# Altium schematic sheet BIAS_CIRCUIT_BOARD.SchDoc
size 420 x 297 mm; SheetNumber: 1; SheetTotal: 1; Razrabotal: {Разработал}; Proveril: {Проверил}; Tkontr: {Т.контр}; Nkontr: {Н. контр.}; Utverdil: {Утвердил}; Oboznachenie: {Обозначение}; Naimenovanie: {Наименование}; Naymenuvannya2: {Найменування2}; MisceVudannya: {Місце видання}
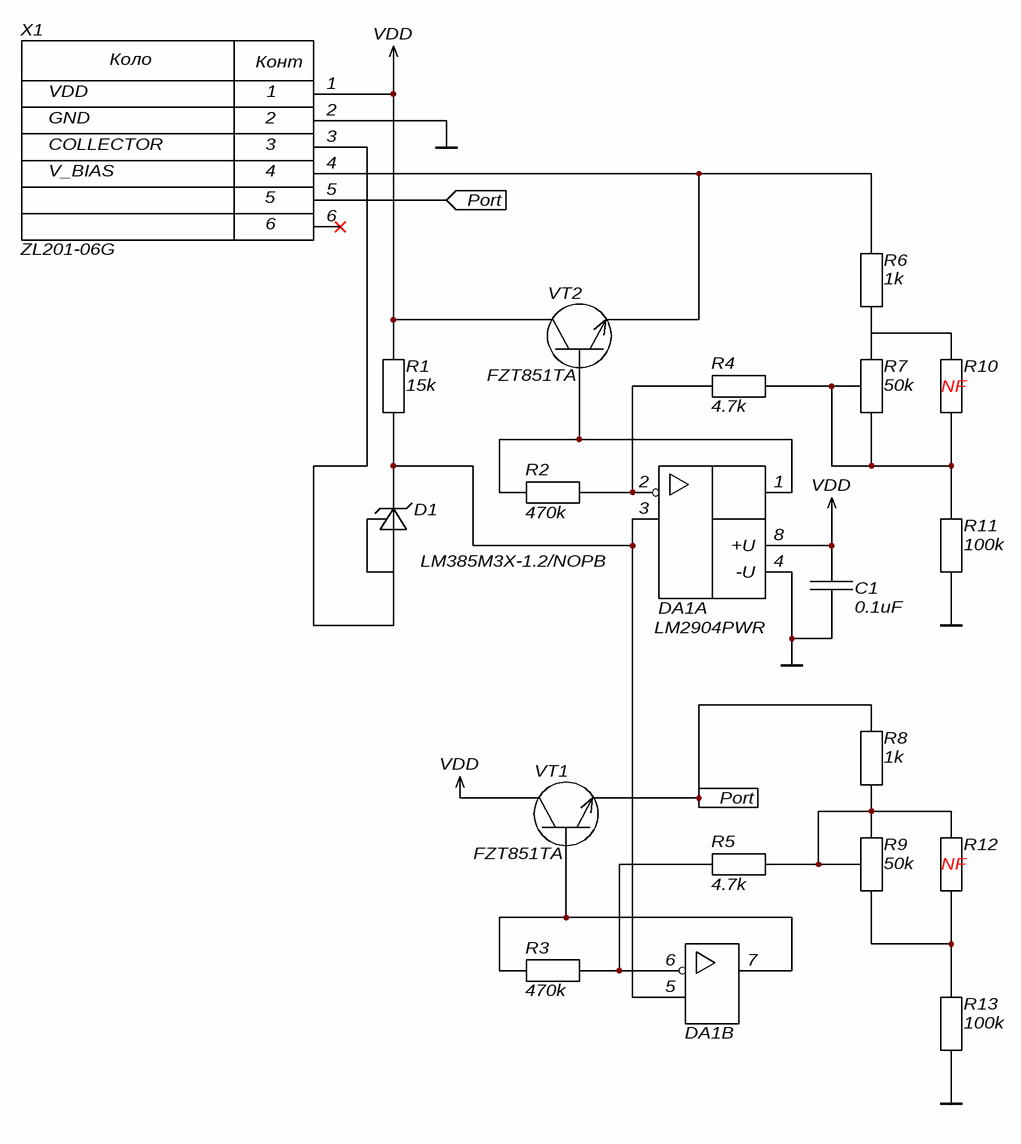
[diagram p0: BIAS_CIRCUIT_BOARD.SchDoc]

## Parts
C1  0.1uF  [CAP_0603]
D1  LM385M3X-1.2/NOPB  [LM385]
DA1  LM2904PWR  [LM2904PWR]  (parts A,B of 2)
R1  15k  [RC0603N_YAG-L]
R2  470k  [RC0603N_YAG-L]
R3  470k  [RC0603N_YAG-L]
R4  4.7k  [RC0603N_YAG-L]
R5  4.7k  [RC0603N_YAG-L]
R6  1k  [RC0603N_YAG-L]
R7  50k  [3214W-1-503E]
R8  1k  [RC0603N_YAG-L]
R9  50k  [3214W-1-503E]
R10  *  [RC0603N_YAG-L]  (value not drawn)
R11  100k  [RC0603N_YAG-L]
R12  *  [RC0603N_YAG-L]  (value not drawn)
R13  100k  [RC0603N_YAG-L]
VT1  FZT851TA  [SOT223_DN_FZT_DIO-L]
VT2  FZT851TA  [SOT223_DN_FZT_DIO-L]
X1  ZL201-06G  [ZL319-6P]

## Ports
Port (in, see BIAS_CIRCUIT_BOARD[3A]), Port (in, see BIAS_CIRCUIT_BOARD[3C])

## Nets
GND: C1.1 DA1.4(-U) R11.1 R13.1 X1.2
VDD: C1.2 DA1.8(+U) R1.2 VT1.2(k) VT2.2(k) X1.1
Port: R8.2 VT1.3(e) X1.5 ; port Port
NetD1_1: D1.1 DA1.3(IN2+) DA1.5(IN2+) R1.1
NetD1_2: D1.2 D1.3 X1.3
NetDA1_1: DA1.1(OUT1) R2.2 VT2.1(b)
NetDA1_2: DA1.2(IN1-) R2.1 R4.2
NetDA1_6: DA1.6(IN1-) R3.1 R5.2
NetDA1_7: DA1.7(OUT1) R3.2 VT1.1(b)
NetR4_1: R4.1 R7.1 R7.3 R10.1 R11.2
NetR5_1: R5.1 R8.1 R9.2 R9.3 R12.2
NetR6_1: R6.1 R7.2 R10.2
NetR6_2: R6.2 VT2.3(e) X1.4
NetR9_1: R9.1 R12.1 R13.2

Not connected (* = marked no-connect by the designer): X1 6(2)*

## Notes on the sheet
- (near R10) NF
- (near R12) NF
- Перв. застосування
- Довідк. №
- Підп. і дата
- Інв. № дубл.
- Зам. інв. №
- Зм.
- Розробив
- Арк.
- № докум.
- Підп.
- Дата
- Літ.
- Маса
- Масштаб
- Перевірив
- Т.контр.
- Схема електрична принципова
- Аркуш
- Аркушів
- Інв. № оріг.
- Н.контр.
- Затв.
- ALTIUM GOSTBOM2.0 KEV
- Файл:
- Копіював
- Формат А3
- (in symbol ZL201-06G_1) Коло; Конт; VDD; GND; COLLECTOR; V_BIAS

## Library data of the parts
C1 = CAPASITOR_0603
D1 = LM385M3X-1.2/NOPB: LM385M3X-1.2/NOPB, SOT-23-3, TI; ComponentLink1Description: Datasheet; ComponentLink1URL: https://www.ti.com/lit/ds/symlink/lm185-1.2-n.pdf?ts=1757397643324
DA1 = LM2904PWR: LM2904PWR, TSSOP, TI; ComponentLink1Description: Datasheet; ComponentLink1URL: https://www.ti.com/lit/ds/symlink/lm2904.pdf?ts=1762592653516&ref_url=https%253A%252F%252Fwww.ti.com%252Fproduct%252FLM2904%253Futm_source%253Dgoogle%2526utm_medium%253Dcpc%2526utm_campaign%253Dasc-amps-null-44700045336317476_prodfolderdynamic-cpc-pf-google-eu_en_int%2526utm_content%253Dprodfolddynamic%2526ds_k%253DDYNAMIC+SEARCH+ADS%2526DCM%253Dyes%2526gclsrc%253Daw.ds%2526gad_source%253D1%2526gad_campaignid%253D8751784064%2526gbraid%253D0AAAAAC068F2Jj8cWNr6MbiQMqKOJ94by2%2526gclid%253DCjwKCAiA8bvIBhBJEiwAu5ayrPYk3AikubklvKvJ7sx7r7PcstoJJPYu8ilBJi-cdwp2x1pJwQd5vhoCyGYQAvD_BwE
R1-R6 R8 R10-R13 = RES_0603: ComponentLink1Description: Datasheet; ComponentLink1URL: https://www.digikey.com/Site/Global/Layouts/DownloadPdf.ashx?pdfUrl=79FA4E6269084805AAD01E8F0265FFC8
R7 R9 = TRIMPOT 50K: 3214W-1-503E, 50k, 1/4W, 5 Turn - Bourns; ComponentLink1Description: Datasheet; ComponentLink1URL: https://www.bourns.com/docs/Product-Datasheets/3214.pdf
X1 = ZL201-06G_1: System: Connector; ComponentLink1Description: New link; ComponentLink1URL: https://www.tme.eu/Document/cc301e58a5da78cb543a94b5a5b7f06a/DS1021.pdf
VT1 VT2 = FZT851TA: ComponentLink1Description: Datasheet; ComponentLink1URL: https://www.rcscomponents.kiev.ua/datasheets/2SC5707.pdf